# Altium schematic sheet Connectors.SchDoc
size 431 x 279 mm; DrawnBy: Frank Chaqueco; Organization: ORGANIZATION; Address1: ADDRESS 1; Address2: ADDRESS 2; Address3: ADDRESS 3; Address4: ADDRESS 4; Revision: -; SheetNumber: 1; SheetTotal: 3; ENG_APP_DATE: --/--/--; DSN_APP_DATE: --/--/--; CHK_APP_DATE: --/--/--
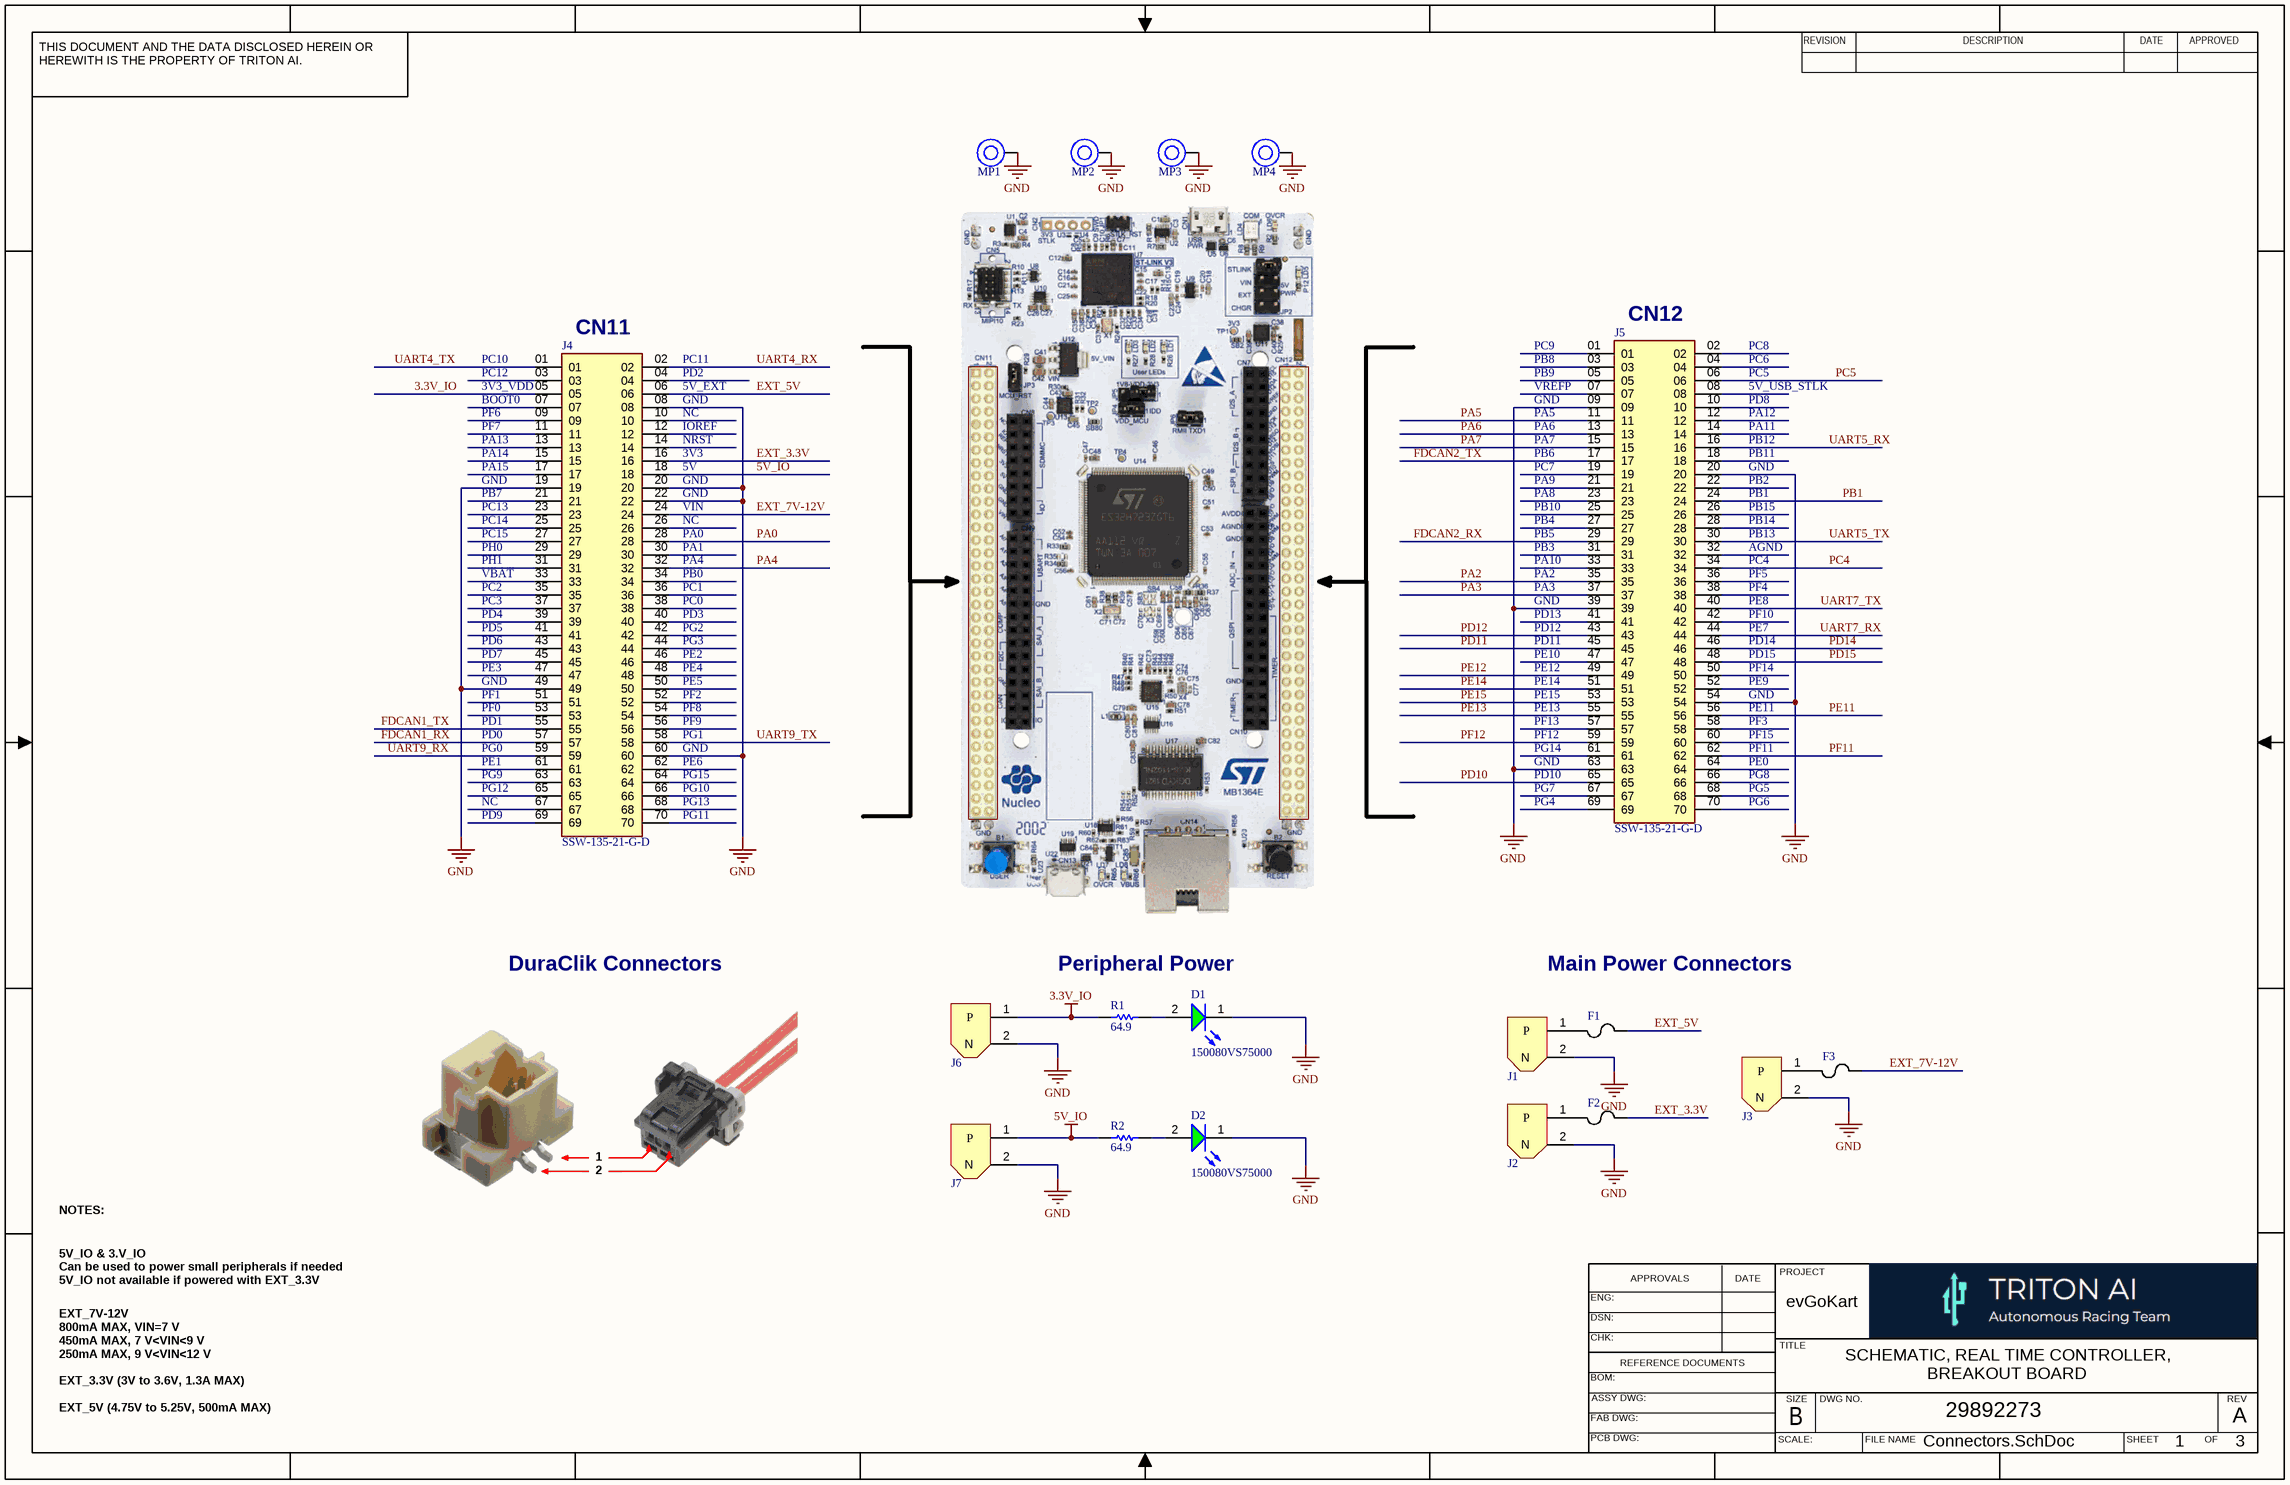
[diagram p0: Connectors.SchDoc]

## Parts
D1  150080VS75000  [WL-SMCW_0805_150080xx75000]
D2  150080VS75000  [WL-SMCW_0805_150080xx75000]
F1  500mA  [FUS_VISHAY_MFU0805_VIS]  (value not drawn)
F2  1.5A  [FUS_VISHAY_MFU0805_VIS]  (value not drawn)
F3  800mA  [FUS_VISHAY_MFU0805_VIS]  (value not drawn)
J1  XT30UPB-M  [XT30UPB-M]  (value not drawn)
J2  XT30UPB-M  [XT30UPB-M]  (value not drawn)
J3  XT30UPB-M  [XT30UPB-M]  (value not drawn)
J4  SSW-135-21-G-D  [SAMTEC_SSW-135-21-G-D]
J5  SSW-135-21-G-D  [SAMTEC_SSW-135-21-G-D]
J6  XT30UPB-M  [XT30UPB-M]  (value not drawn)
J7  XT30UPB-M  [XT30UPB-M]  (value not drawn)
MP1  M2.5 x 9mm  [9774090151]  (value not drawn)
MP2  M2.5 x 9mm  [9774090151]  (value not drawn)
MP3  M2.5 x 9mm  [9774090151]  (value not drawn)
MP4  M2.5 x 9mm  [9774090151]  (value not drawn)
R1  64.9  [RESC2013X60X35LL10T20]
R2  64.9  [RESC2013X60X35LL10T20]

## Nets
3.3V_IO: J4.05 J6.1(P) R1.2
5V_IO: J4.18 J7.1(P) R2.2
GND: D1.1(K) D2.1(K) J1.2(N) J2.2(N) J3.2(N) J4.08 J4.19 J4.20 J4.22 J4.49 J4.60 J5.09 J5.20 J5.39 J5.54 J5.63 J6.2(N) J7.2(N) MP1.1 MP2.1 MP3.1 MP4.1
EXT_3.3V: F2.1 J4.16
EXT_5V: F1.1 J4.06
EXT_7V-12V: F3.1 J4.24
FDCAN1_RX: J4.57
FDCAN1_TX: J4.55
FDCAN2_RX: J5.29
FDCAN2_TX: J5.17
PA0: J4.28
PA2: J5.35
PA3: J5.37
PA4: J4.32
PA5: J5.11
PA6: J5.13
PA7: J5.15
PB1: J5.24
PC4: J5.34
PC5: J5.06
PD10: J5.65
PD11: J5.45
PD12: J5.43
PD14: J5.46
PD15: J5.48
PE11: J5.56
PE12: J5.49
PE13: J5.55
PE14: J5.51
PE15: J5.53
PF11: J5.62
PF12: J5.59
UART4_RX: J4.02
UART4_TX: J4.01
UART5_RX: J5.16
UART5_TX: J5.30
UART7_RX: J5.44
UART7_TX: J5.40
UART9_RX: J4.59
UART9_TX: J4.58
NetD1_2: D1.2(A) R1.1
NetD2_2: D2.2(A) R2.1
NetF1_2: F1.2 J1.1(P)
NetF2_2: F2.2 J2.1(P)
NetF3_2: F3.2 J3.1(P)

Not connected (* = marked no-connect by the designer): J4 03 04 07 09 10 11 12 13 14 15 17 21 23 25 26 27 29 30 31 33 34 35 36 37 38 39 40 41 42 43 44 45 46 47 48 50 51 52 53 54 56 61 62 63 64 65 66 67 68 69 70; J5 01 02 03 04 05 07 08 10 12 14 18 19 21 22 23 25 26 27 28 31 32 33 36 38 41 42 47 50 52 57 58 60 61 64 66 67 68 69 70

## Notes on the sheet
- PC10
- (near J4) CN11
- (near J4) PC11
- PC9
- PB8
- (near J5) CN12
- PC8
- PC6
- PC12
- (near J4) 3V3_VDD
- (near J4) BOOT0
- PF6
- PF7
- (near J4) PD2
- (near J4) 5V_EXT
- (near J4) GND
- (near J4) NC
- (near J4) IOREF
- PB9
- (near J5) VREFP
- GND
- PA5
- PA6
- PC5
- 5V_USB_STLK
- PD8
- PA12
- PA11
- PA13
- PA14
- PA15
- PB7
- (near J4) NRST
- (near J4) 3V3
- (near J4) 5V
- PA7
- PB6
- PC7
- PA9
- PA8
- PB12
- PB11
- PB2
- PB1
- PC13
- PC14
- PC15
- PH0
- PH1
- (near J4) VIN
- (near J4) PA0
- (near J4) PA1
- (near J4) PA4
- PB10
- PB4
- PB5
- PB3
- PA10
- PB15
- PB14
- PB13
- AGND
- PC4
- VBAT
- PC2
- PC3
- PD4
- PD5
- (near J4) PB0
- (near J4) PC1
- (near J4) PC0
- (near J4) PD3
- (near J4) PG2
- PA2
- PA3
- PD13
- PD12
- PF5
- PF4
- PE8
- PF10
- PE7
- PD6
- PD7
- PE3
- PF1
- (near J4) PG3
- (near J4) PE2
- (near J4) PE4
- (near J4) PE5
- (near J4) PF2
- PD11
- PE10
- PE12
- PE14
- PE15
- PD14
- PD15
- PF14
- PE9
- PF0
- PG0
- PE1
- PD1
- PD0
- (near J4) PF8
- (near J4) PF9
- (near J4) PG1
- (near J4) PE6
- PE13
- PF13
- PF12
- PG14
- PE11
- PF3
- PF15
- PF11
- PE0
- PG9
- PG12
- NC
- PD9
- (near J4) PG15
- (near J4) PG10
- (near J4) PG13
- (near J4) PG11
- PD10
- PG7
- PG4
- PG8
- PG5
- PG6
- DuraClik Connectors
- Peripheral Power
- Main Power Connectors
- 1
- NOTES:
- 2
- 5V_IO & 3.V_IO
  Can be used to power small peripherals if needed
  5V_IO not available if powered with EXT_3.3V
- evGoKart
- SCHEMATIC, REAL TIME CONTROLLER,
- EXT_7V-12V
  800mA MAX, VIN=7 V
  450mA MAX, 7 V<VIN<9 V
  250mA MAX, 9 V<VIN<12 V
  EXT_3.3V (3V to 3.6V, 1.3A MAX)
  EXT_5V (4.75V to 5.25V, 500mA MAX)
- BREAKOUT BOARD
- 29892273
- A
- Connectors.SchDoc
- 3
- THIS DOCUMENT AND THE DATA DISCLOSED HEREIN OR HEREWITH IS THE PROPERTY OF TRITON AI.
- REVISION
- DESCRIPTION
- DATE
- APPROVED
- ENG:
- APPROVALS
- PROJECT
- DSN:
- CHK:
- REFERENCE DOCUMENTS
- TITLE
- BOM:
- FAB DWG:
- PCB DWG:
- ASSY DWG:
- SCALE:
- SIZE
- B
- DWG NO.
- FILE NAME
- SHEET
- OF
- REV

## Library data of the parts
D1 D2 = CMP-1426-00009-6: WL-SMCW SMT Mono-Color Chip LED Waterclear; Max Junction Temperature (Tj): 95°C; Max Reverse Voltage (DC): 5V; Luminous Intensity: 40mcd; Color: Green; Peak Wavelength: 572nm; Wavelength: 570nm; Viewing Angle: 140°; Power Dissipation: 72mW; Forward Current: 100mA; Test Current: 20mA; Forward Voltage: 2V; Lens Style: Clear, Rectangular; Reverse Voltage: 5V; Length: 2mm; RoHS: Compliant; Min Operating Temperature: -40°C; REACH SVHC: Unknown; Packaging: Tape and Reel; Case/Package: 0805; Max Operating Temperature: 85°C; Case Code (Metric): 2012; Width: 1.25mm; Dominant Wavelength: 570nm; Mount: Surface Mount; Case Code (Imperial): 0805; Height: 700µm
F1 = MFU0805FF00500P500: Mfr_Name: Vishay; Current Rating: 500mA
F2 = MFU0805FF01500P100: Mfr_Name: Vishay; Current Rating: 1.5A
F3 = MFU0805FF00800P100: Mfr_Name: Vishay; Current Rating: 800mA
J1-J3 J6 J7 = XT30UPB-M: Socket; DC supply; XT30; male; PIN: 2; on PCBs; THT; yellow; 15A; 500V; MF: amass; MP: XT30UPB-M; Value: *; SnapEDA_Link: https://www.snapeda.com/parts/XT30UPB-M/AMASS/view-part/?ref=snap; Price: None; Package: None; Check_prices: https://www.snapeda.com/parts/XT30UPB-M/AMASS/view-part/?ref=eda; Availability: Not in stock
J4 J5 = SSW-135-21-G-D: MF: {'manufacturer': u'Samtec Inc.'}; Package: None; Price: None; Value: *; MP: SSW-135-21-G-D; Availability: Unavailable
MP1-MP4 = 9774090151R: WA-SMSI SMT Steel Spacer with internal Thread, OD 5.1mm, M2.5 x 9mm; Manufacturer: Wurth Elektronik; Inside Diameter: 3.5mm; Surface: Tin; ComponentLink1Description: Website Link; ComponentLink1URL: https://www.we-online.com/redexpert/article/9774090151R?ad; ComponentLink2Description: Datasheet Link; ComponentLink2URL: https://www.we-online.com/redexpert/spec/9774090151R?ad; Manufacturer Part Number: 9774090151R; Category: SMT Spacers; Match Code: WA-SMSI; Mount: Surface Mount; Operating Temperature Max: 150°C; Operating Temperature Min: -55°C; Packaging: Tape and Reel; Height: 9mm; Material: Steel; Outside Diameter: 5.1mm; Thread Size: M2.5
R1 R2 = CMP-2001-01223-1: Part Number: RC0805FR-0764R9L; Manufacturer: Yageo